# EAGLE design pcmtest_withboard (EAGLE 7.2.0)
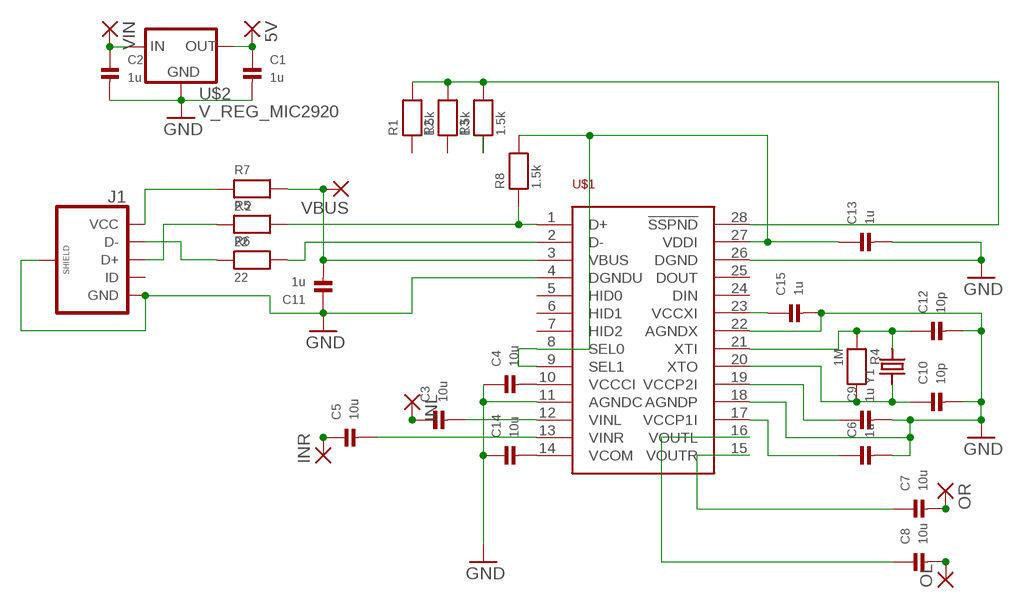
[diagram p0: schematic, sheet 1]

## Parts
5V  SMD2  [SMD1,27-2,54]
C1  1u  CAP_CERAMIC_0603  [_0603]
C2  1u  CAP_CERAMIC_0603  [_0603]
C3  10u  CAP_CERAMIC_0603  [_0603]
C4  10u  CAP_CERAMIC_0603  [_0603]
C5  10u  CAP_CERAMIC_0603  [_0603]
C6  1u  CAP_CERAMIC_0603  [_0603]
C7  10u  CAP_CERAMIC_0603  [_0603]
C8  10u  CAP_CERAMIC_0603  [_0603]
C9  1u  CAP_CERAMIC_0603  [_0603]
C10  10p  CAP_CERAMIC_0603  [_0603]
C11  1u  CAP_CERAMIC_0603  [_0603]
C12  10p  CAP_CERAMIC_0603  [_0603]
C13  1u  CAP_CERAMIC_0603  [_0603]
C14  10u  CAP_CERAMIC_0603  [_0603]
C15  1u  CAP_CERAMIC_0603  [_0603]
INL  SMD2  [SMD1,27-2,54]
INR  SMD2  [SMD1,27-2,54]
J1  USB_MICROB_PLUGCONN-11752  [USB-B-MICRO-SMD_V03]
OL  SMD2  [SMD1,27-2,54]
OR  SMD2  [SMD1,27-2,54]
R1  1.5k  RESISTOR_0603  [_0603]
R2  1.5k  RESISTOR_0603  [_0603]
R3  1.5k  RESISTOR_0603  [_0603]
R4  1M  RESISTOR_0603  [_0603]
R5  22  RESISTOR_0603  [_0603]
R6  22  RESISTOR_0603  [_0603]
R7  2.2  RESISTOR_0603  [_0603]
R8  1.5k  RESISTOR_0603  [_0603]
U$1  PCM2906  [SSOP28]
U$2  V_REG_MIC2920  [SOT223]
VBUS  SMD2  [SMD1,27-2,54]
VIN  SMD2  [SMD1,27-2,54]
Y1  CRYSTAL2.5X2.0MM  [CRYSTAL_2.5X2]

## Nets
GND: C1.2 C2.2 C4.1 C6.2 C9.2 C10.2 C11.1 C12.2 C13.2 C14.1 C15.2 J1.GND J1.SHIELD1(SHIELD) J1.SHIELD2(SHIELD) J1.SHIELD3(SHIELD) U$1.4(DGNDU) U$1.11(AGNDC) U$1.18(AGNDP) U$1.22(AGNDX) U$1.26(DGND) U$2.2(GND)
N$1: C3.1 INL.1(P)
N$2: C4.2 U$1.10(VCCCI)
N$3: C5.1 INR.1(P)
N$4: C7.2 OR.1(P)
N$5: R3.1
N$6: R5.2 R8.1 U$1.1(D+)
N$7: R6.2 U$1.2(D-)
N$8: J1.D- R6.1
N$9: J1.D+ R5.1
N$10: 5V.1(P) C1.1 U$2.3(OUT)
N$11: C2.1 U$2.1(IN) VIN.1(P)
N$12: J1.VBUS(VCC) R7.1
N$13: C11.2 R7.2 U$1.3(VBUS) VBUS.1(P)
N$14: C13.1 R8.2 U$1.8(SEL0) U$1.9(SEL1) U$1.27(VDDI)
N$15: C5.2 U$1.13(VINR)
N$16: C3.2 U$1.12(VINL)
N$17: C8.2 OL.1(P)
N$18: C14.2 U$1.14(VCOM)
N$19: R1.2 R2.2 R3.2 U$1.28(!SSPND)
N$20: C15.1 U$1.23(VCCXI)
N$23: C12.1 R4.1 U$1.21(XTI) Y1.3
N$24: C10.1 R4.2 U$1.20(XTO) Y1.1
N$25: C9.1 U$1.19(VCCP2I)
N$27: C6.1 U$1.17(VCCP1I)
N$29: C8.1 U$1.16(VOUTL)
N$30: C7.1 U$1.15(VOUTR)
Unconnected: J1.ID R1.1 R2.1 U$1.5(HID0) U$1.6(HID1) U$1.7(HID2) U$1.24(DIN) U$1.25(DOUT)

## Library data of the parts
5V INL INR OL OR VBUS VIN = wirepad:SMD2: SMD PAD
C1-C15 = microbuilder:CAP_CERAMIC: Ceramic Capacitors 0402 - 0402 Surface Mount Capacitors 16pF 50V 5% [Digikey: 445-4899-2-ND] 18pF 50V 5% [Digikey: 490-1281-2-ND] 22pF 50V 5% [Digikey: 490-1283-2-ND] 68pF 50V 5% [Digikey: 490-1289-2-ND] 0.1uF 10V 10% [Digikey: 490-1318-2-ND] 1.0uF 6.3V 10% [Digikey: 490-1320-2-ND] 0603 - 0603 Surface Mount Capacitors 16 pF 50V 5% [Digikey: 445-5051-2-ND] 22 pF 50V [Digikey: PCC220ACVTR-ND] 33 pF 50V 5% [Digikey: 490-1415-1-ND] 56pF 50V 5% [Digikey: 490-1421-1-ND] 220pF 50V 5% [Digikey: 445-1285-1-ND] 680 pF 50V 2200 pF 50V 5% C0G [Digikey: 445-1297-1-ND] 5600 pF 100V 5% X7R [Digikey: 478-3711-1-ND] 0.1 µF 25V 10% [Digikey: PCC2277TR-ND] 0.22 µF 16V 10% X7R [Digikey: 445-1318-1-ND] 1.0 µF 25V 10% [Digikey: 445-5146-2-ND] 0603 - RF Specific 3pF 250V +/-0.1pF RF [Digikey: 712-1347-1-ND] 18 pF 250V 5% [Digikey: 478-3505-1-ND or 712-1322-1-ND] 56 pF 250V 5% C0G RF [Digikey: 490-4867-1-ND] 68 pF 250V RF [Digikey: 490-4868-1-ND] 0805 - 0805 Surface Mount Capacitors 220 pF 250V 2% RF Ceramic Capacitor [Digikey: 712-1398-1-ND] 1000 pF 50V 2% NP0 Ceramic Capacitor [Digikey: 478-3760-1-ND] 0.1 µF 25V 10% Ceramic Capacitor [Digikey: PCC1828TR-ND] 1.0 µF 16V 10% Ceramic Capacitor[Digikey: 490-1691-2-ND] 10.0 µF 10V 10% Ceramic Capacitor[Digikey: 709-1228-1-ND] 10.0 uF 16V 10% Ceramic Capacitor [Digikey: 478-5165-2-ND] 47 uF 6.3V 20% Ceramic Capacitor [Digikey: 587-1779-1-ND or 399-5506-1-ND] 1206 - 1206 Surface Mount Capacitors 47uF 10V 20% Ceramic Capacitor [Digikey: 490-5528-1-ND or 399-5508-1-ND or 445-6010-1-ND] 100uF 6.3V -20%, +80% Y5V Ceramic Capacitor (Digikey: 490-4512-1-ND, Mouser: 81-GRM31CF50J107ZE1L)
J1 = SparkFun-Connectors:USB_MICROB_PLUG: USB Micro-B connectors Some male, some female. Watch your step!; PROD_ID: CONN-11752
R1-R8 = microbuilder:RESISTOR: Resistors 0402 - 0402 Surface Mount Package 22 Ohm 1% 1/16W [Digikey: 311-22.0LRTR-ND] 33 Ohm 5% 1/16W 1.0K 5% 1/16W 1.5K 5% 1/16W 2.0K 1% 1/16W 10.0K 1% 1/16W [Digikey: 311-10.0KLRTR-ND] 10.0K 5% 1/16W [Digikey: RMCF0402JT10K0TR-ND] 12.1K 1% 1/16W [Digikey: 311-22.0LRTR-ND] 100.0K 5% 1/16W 0603 - 0603 Surface Mount Package 0 Ohm 1/10 Watt 1% Resistor 15 Ohm 1/10 Watt 1% Resistor 33 Ohm 1/10 Watt 1% Resistor 49.9 Ohm 1/10 Watt 1% Resistor 100 Ohm 1/10 Watt 1% Resistor 150 Ohm 1/10 Watt 1% Resistor 240 Ohm 1/10 Watt 1% Resistor 390 Ohm 1/10 Watt 1% Resistor 560 Ohm 1/10 Watt 1% Resistor 680 Ohm 1/10 Watt 1% Resistor 750 Ohm 1/10 Watt 1% Resistor 1.0K Ohm 1/10 Watt 1% Resistor 1.5K Ohm 1/10 Watt 1% Resistor 2.0K Ohm 1/10 Watt 1% Resistor 2.2K Ohm 1/10 Watt 1% Resistor 3.3K Ohm 1/10 Watt 1% Resistor 4.7K Ohm 1/10 Watt 1% Resistor 10.0K Ohm 1/10 Watt 1% Resistor 12.0K Ohm 1/10 Watt 1% Resistor 12.1K Ohm 1/10 Watt 1% Resistor 20.0K Ohm 1/10 Watt 1% Resistor 33.0K Ohm 1/10 Watt 1% Resistor 100.0K Ohm 1/10 Watt 1% Resistor 0805 - 0805 Surface Mount Package 0 Ohm 1/8 Watt 1% Resistor 33 Ohm 1/8 Watt 1% Resistor 100 Ohm 1/8 Watt 1% Resistor 150 Ohm 1/8 Watt 1% Resistor 200 Ohm 1/8 Watt 1% Resistor 240 Ohm 1/8 Watt 1% Resistor 330 Ohm 1/8 Watt 1% Resistor 390 Ohm 1/8 Watt 1% Resistor 470 Ohm 1/8 Watt 1% Resistor 1.0K Ohm 1/8 Watt 1% Resistor 1.5K Ohm 1/8 Watt 1% Resistor 2.0K Ohm 1/8 Watt 1% Resistor 4.7K Ohm 1/8 Watt 1% Resistor 5.1K Ohm 1/8 Watt 1% Resistor 5.6K Ohm 1/8 Watt 1% Resistor 10.0K Ohm 1/8 Watt 1% Resistor 22.0K Ohm 1/8 Watt 1% Resistor 33.0K Ohm 1/8 Watt 1% Resistor 100K Ohm 1/8 Watt 1% Resistor 1206 - 1206 Surface Mount Package 2012 - 2010 Surface Mount Package 0.11 Ohm 1/2 Watt 1% Resistor - Digikey: RHM.11UCT-ND
U$1 = PCM2906:PCM2906
U$2 = SparkFun-PowerIC:V_REG_MIC2920: MIC2920A (http://www.micrel.com/_PDF/mic2920.pdf) - 400mA output LDO Regulator
Y1 = microbuilder:CRYSTAL: Crystals HC49UP - Surface Mount Crystal 4.0MHz 18pF +/-30ppm Surface Mount Crystal [Digikey: 535-9857-1-ND] 12.0 MHz Surface Mount Crystal [Digikey: 535-9869-6-ND] 25.0 MHz Surface Mount Crystal [Digikey: 535-9078-1-ND] 2.5 x 2.0mm - MEMs SMT Crystal 16.0 MHz 10pF 20ppm 2.5 x 2.0mm Crystal [Digikey -40-85°C: 535-10923-1-ND] 3.2 x 2.5mm - MEMs SMT Crystal 12.0 MHz 8pF 15ppm 3.2 x 2.5mm Crystal [Digikey: -10-70°C: 644-1047-1-ND -40-125°C: 644-1128-1-ND] 16.0 MHz 8pF 15ppm 3.2 x 2.5mm Crystal [Digikey: -10-70°C: 644-1049-1-ND -40-125°C: 644-1129-2-ND] 16.0 MHz 10pF 10ppm 3.2 x 2.5mm Crystal [Digikey: 644-1100-1-ND] 27.12 MHz 18pF 30ppm 3.2 x 2.5mm Crystal [Digikey: 887-1424-1-ND] 27.12MHz 10pF 10ppm 3.2 x 2.5mm Crystal [Digikey: 887-1329-1-ND] 4.9 x 1.8mm - MEMs SMT Crystal 32.768 KHz 12.5pF 20ppm 4.9 x 1.8mm Crystal [Digikey: SE2415CT-ND] 8.0 x 3.8mm - Surface Mount Crystal 32.768kHz 12.5pF 20ppm -40°C-85°C [Digikey: 535-9166-2-ND] Cylinder 32.768KHz Cylinder Crystal (2x6mm body) [Ex. Digikey: 300-8341-2-ND]

## Board
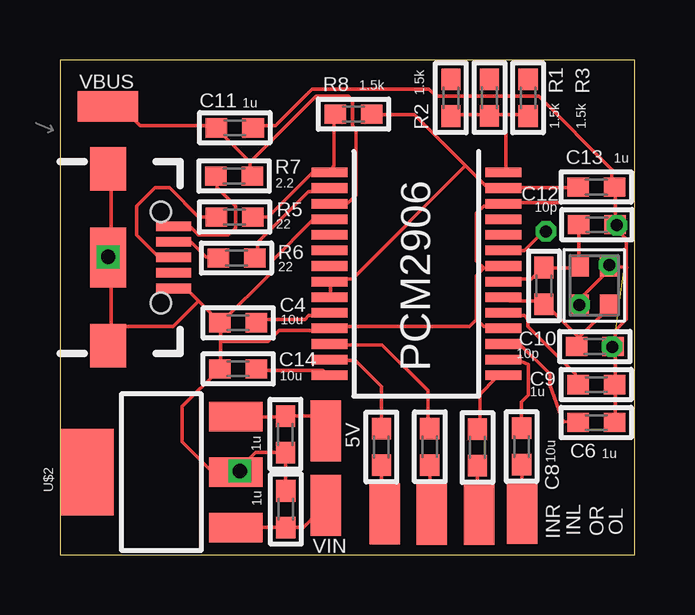
[diagram p1: board, top side]
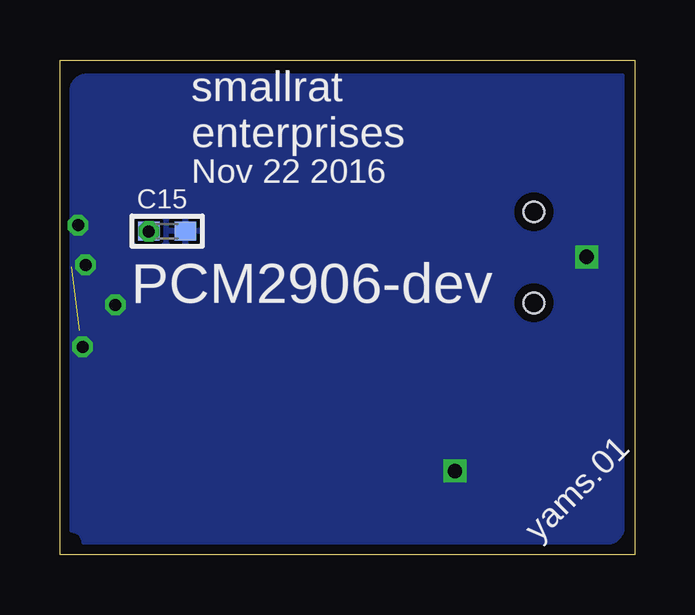
[diagram p2: board, bottom side, seen from below]

Size 23.97 x 20.64 mm. Coordinates in mm from the lower left corner, seen from the top.
Outline: 0,0 23.97,0 23.97,20.64 0,20.64 0,0
Copper layers (1*16): Top 0.0356mm / dielectric 1.5011mm / Bottom 0.0356mm
Design rules "oshpark-2layer": minimum track width 6mil, minimum drill 13mil, track to track 6mil, track to pad 6mil, pad to pad 6mil, via to via 6mil, smd to smd 6mil, copper to edge 15mil, drill to drill 6mil, minimum pad ring 7mil, minimum via ring 7mil, stop-mask expansion 2.5mil, vias tented up to drill 0mil, thermal gap 10mil

### Footprints (pad centres in the part's own frame; a part is rotated, then mirrored left to right if it is on the bottom)
SMD1,27-2,54 = smd 1.27 x 2.54: 1 0,0
_0603 = smd 0.9 x 0.8: 1 -0.762,0; 2 0.762,0
USB-B-MICRO-SMD_V03 = smd 1.45 x 0.4: D+ 2.725,0; D- 2.725,0.65; GND 2.725,-1.3; ID 2.725,-0.65; VBUS 2.725,1.3 | smd 1.5 x 1.8: SHIELD1 0,3.685; SHIELD2 0,-3.685 | smd 1.5 x 2.5: SHIELD3 0,0 | hole 0.85: 2.2,1.9; 2.2,-1.9
SSOP28 = smd 0.4 x 1.5: 1 -4.225,-3.625; 2 -3.575,-3.625; 3 -2.925,-3.625; 4 -2.275,-3.625; 5 -1.625,-3.625; 6 -0.975,-3.625; 7 -0.325,-3.625; 8 0.325,-3.625; 9 0.975,-3.625; 10 1.625,-3.625; 11 2.275,-3.625; 12 2.925,-3.625; 13 3.575,-3.625; 14 4.225,-3.625; 15 4.225,3.625; 16 3.575,3.625; 17 2.925,3.625; 18 2.275,3.625; 19 1.625,3.625; 20 0.975,3.625; 21 0.325,3.625; 22 -0.325,3.625; 23 -0.975,3.625; 24 -1.625,3.625; 25 -2.275,3.625; 26 -2.925,3.625; 27 -3.575,3.625; 28 -4.225,3.625
SOT223 = smd 1.219 x 2.235: 1 -2.311,-3.099; 2 0,-3.099; 3 2.311,-3.099 | smd 3.6 x 2.2: 4 0,3.099
CRYSTAL_2.5X2 = smd 0.9 x 0.8: 1 -0.825,-0.625; 2 0.825,-0.625; 3 0.825,0.625; 4 -0.825,0.625

### Placement (x,y rotation side)
5V  11.08,5.18 0 top
C1  9.4,5.03 270 top
C2  9.42,1.91 90 top
C3  15.42,4.51 90 top
C4  7.43,9.68 0 top
C5  13.4,4.5 90 top
C6  22.36,5.52 0 top
C7  17.41,4.48 270 top
C8  19.25,4.52 270 top
C9  22.36,7.1 0 top
C10  22.3,8.69 0 top
C11  7.29,17.81 180 top
C12  22.39,13.77 0 top
C13  22.36,15.34 0 top
C14  7.43,7.76 0 top
C15  19.5,13.5 0 bottom
INL  15.5,1.7 0 top
INR  13.55,1.71 0 top
J1  2.01,12.41 0 top
OL  19.27,1.73 0 top
OR  17.47,1.69 0 top
R1  17.91,19.07 270 top
R2  16.3,19.06 270 top
R3  19.52,19.06 270 top
R4  20.18,11.22 270 top
R5  7.28,14.09 0 top
R6  7.36,12.38 0 top
R7  7.26,15.8 0 top
R8  12.24,18.38 0 top
U$1  14.86,11.72 270 top
U$2  4.23,3.45 90 top
VBUS  2,18.7 270 top
VIN  11.08,2.07 0 top
Y1  22.28,11.24 90 top

### Tracks (layer width: path | path; a pad name or v marks a point on that pad's centre or on a via)
GND  (via drill 0.5 pad 0.25, 0.6)  (1 unrouted)
  Top 0.152: 2.13,9.52 2.13,12.26 J1.SHIELD3 2.13,12.42 2.13,16.07 J1.SHIELD1 | 2.13,9.52 2.13,8.76 J1.SHIELD2 2.13,9.52 | 6.71,9.67 6.71,8.91 | 6.71,8.91 6.71,7.84 C14.1 5.09,6.18 5.09,4.72 6.36,3.45 U$2.2 | 5.79,10.59 6.55,9.82 C4.1 6.71,9.67 | 5.79,10.59 5.18,11.2 4.88,11.2 J1.GND | 6.71,8.91 8.69,8.91 9.14,9.37 11.12,9.37 U$1.11 11.28,9.52 17.07,9.52 17.37,9.82 | 6.71,9.67 8.84,11.81 8.84,12.26 10.52,13.94 11.12,13.94 U$1.4 | 2.13,9.52 4.72,9.52 5.79,10.59 | 17.37,9.82 17.68,9.52 18.44,9.52 U$1.18 | 17.37,9.82 17.37,11.65 17.68,11.96 | 17.68,11.96 18.44,11.96 U$1.22 | 17.68,11.96 17.37,12.26 17.37,14.24 17.68,14.55 18.44,14.55 U$1.26 18.59,14.7 23.16,14.7 | C6.2 23.16,5.56 23.16,7.08 C9.2 23.16,7.23 23.16,8.61 C10.2 23.16,8.76 23.16,9.37 23.62,9.82 23.62,13.18 23.16,13.63 C12.2 23.16,13.79 23.16,14.7 | 23.16,14.7 23.16,15.31 C13.2 23.01,15.46 23.01,16.07 19.96,19.12 15.7,19.12 15.39,19.43 10.52,19.43 8.99,17.9 8.08,17.9 C11.1 | C2.2 9.4,2.69 C1.2 8.15,4.27 U$2.2 | U$2.2 7.47,3.5 v7.5,3.5 | v21.66,10.43 21.66,10.66 23,12 23.5,12 | 23.5,12 23.62,12 23.63,11.99 23.51,11.99 23.5,12
  other vias: 2.01,12.43 23.22,13.75 23.03,8.68 22.9,12.09
  pour Bottom: 0.5,20 22.86,20 arc-90 23.5,19.36 23.5,18.5 23.5,1 arc90 23,0.5 1.14,0.5 arc-90 0.5,1.14
N$1
  Top 0.152: C3.1 15.42,1.78 INL.1
N$2
  Top 0.152: C4.2 8.23,9.82 10.21,9.82 10.36,9.98 11.12,9.98 U$1.10
N$3
  Top 0.152: C5.1 13.4,1.8 INR.1
N$4
  Top 0.152: C7.2 17.41,1.75 OR.1
N$6
  Top 0.152: R5.2 8.08,14.09 8.69,14.09 10.52,15.92 11.12,15.92 U$1.1 11.28,16.07 11.43,16.23 11.43,18.36 R8.1
N$7
  Top 0.152: R6.2 8.23,12.42 8.23,13.03 10.36,15.16 11.12,15.16 U$1.2
N$8
  Top 0.152: R6.1 6.55,12.42 6.1,12.42 5.49,13.03 4.88,13.03 J1.D-
N$9
  Top 0.152: R5.1 6.4,14.09 5.79,14.09 4.57,15.31 3.96,15.31 3.2,14.55 3.2,13.33 4.12,12.42 J1.D+
N$10
  Top 0.152: U$2.3 9.37,5.76 C1.1 10.91,5.79 11,5.7 11,5.26 5V.1
N$11
  Top 0.152: U$2.1 C2.1 10.16,1.15 VIN.1
N$12
  Top 0.152: R7.1 6.55,15.77 6.55,15.31 7.32,14.55 7.32,13.63 7.01,13.33 5.79,13.33 5.49,13.63 4.88,13.63 J1.VBUS
N$13
  Top 0.152: 7.92,16.38 7.92,15.92 R7.2 | 7.92,16.38 6.55,17.75 C11.2 6.4,17.9 3.35,17.9 2.38,18.88 | 7.92,16.38 10.67,19.12 12.04,19.12 12.19,18.97 12.19,17.9 12.34,17.75 12.34,15.01 12.04,14.7 11.28,14.7 U$1.3 | 2.29,18.97 2.38,18.88 | VBUS.1 2,18.5 2.38,18.88
N$14
  Top 0.152: U$1.9 11.28,10.89 11.28,11.35 U$1.8 11.28,11.5 12.19,11.5 16.92,16.23 | 16.92,16.23 17.83,15.31 18.44,15.31 U$1.27 18.59,15.31 21.49,15.31 C13.1 | 16.92,16.23 14.78,18.36 13.11,18.36 R8.2
N$15
  Top 0.152: C5.2 13.4,7.03 12.32,8.11 11.27,8.11 U$1.13
N$16
  Top 0.152: 15.31,5.34 C3.2 15.34,5.35 15.34,6.85 13.43,8.76 11.28,8.76 U$1.12
N$17
  Top 0.152: C8.2 19.25,1.75 OL.1
N$18
  Top 0.152: C14.2 8.23,7.69 10.97,7.69 11.12,7.54 U$1.14
N$19
  Top 0.152: R2.2 16.31,18.36 17.83,18.36 R1.2 17.98,18.36 18.59,18.36 | 18.59,18.36 19.51,18.36 R3.2 | 18.59,18.36 18.59,16.07 U$1.28
N$20  (via drill 0.5 pad 0.25)
  Top 0.152: v20.27,13.49 20,13.33 19.36,12.7 U$1.23
  Bottom 0.152: C15.1 v20.27,13.49
N$23
  Top 0.152: 21.64,13.63 C12.1 21.64,13.76 21.64,12.11 Y1.3 21.64,11.96 20.27,11.96 R4.1 20.12,11.96 19.66,11.5 18.59,11.5 U$1.21
N$24
  Top 0.152: U$1.20 18.59,10.74 18.75,10.59 20.12,10.59 R4.2 20.27,10.44 21.64,9.06 | 21.64,9.06 21.64,8.76 C10.1 21.64,9.06 | 21.64,9.06 22.86,10.28 Y1.1
N$25
  Top 0.152: C9.1 21.49,7.23 21.49,7.54 19.51,9.52 19.51,9.82 19.36,9.98 18.59,9.98 U$1.19
N$27
  Top 0.152: C6.1 20.99,5.56 20.99,5.51 20.42,7.08 20.42,7.54 19.2,8.76 18.59,8.76 U$1.17
N$29
  Top 0.152: U$1.16 19.05,8.14 19.54,7.95 19.54,6.67 19.23,6.38 19.23,5.23 C8.1
N$30
  Top 0.152: 17.44,5.34 C7.1 17.5,5.33 17.5,6.7 18.19,7.39 18.44,7.39 U$1.15

### Text on the board
bNames: smallrat / enterprises | Nov 22 2016 | PCM2906-dev | yams.01